# Altium schematic sheet dehumidifer_v2.SchDoc
size A4
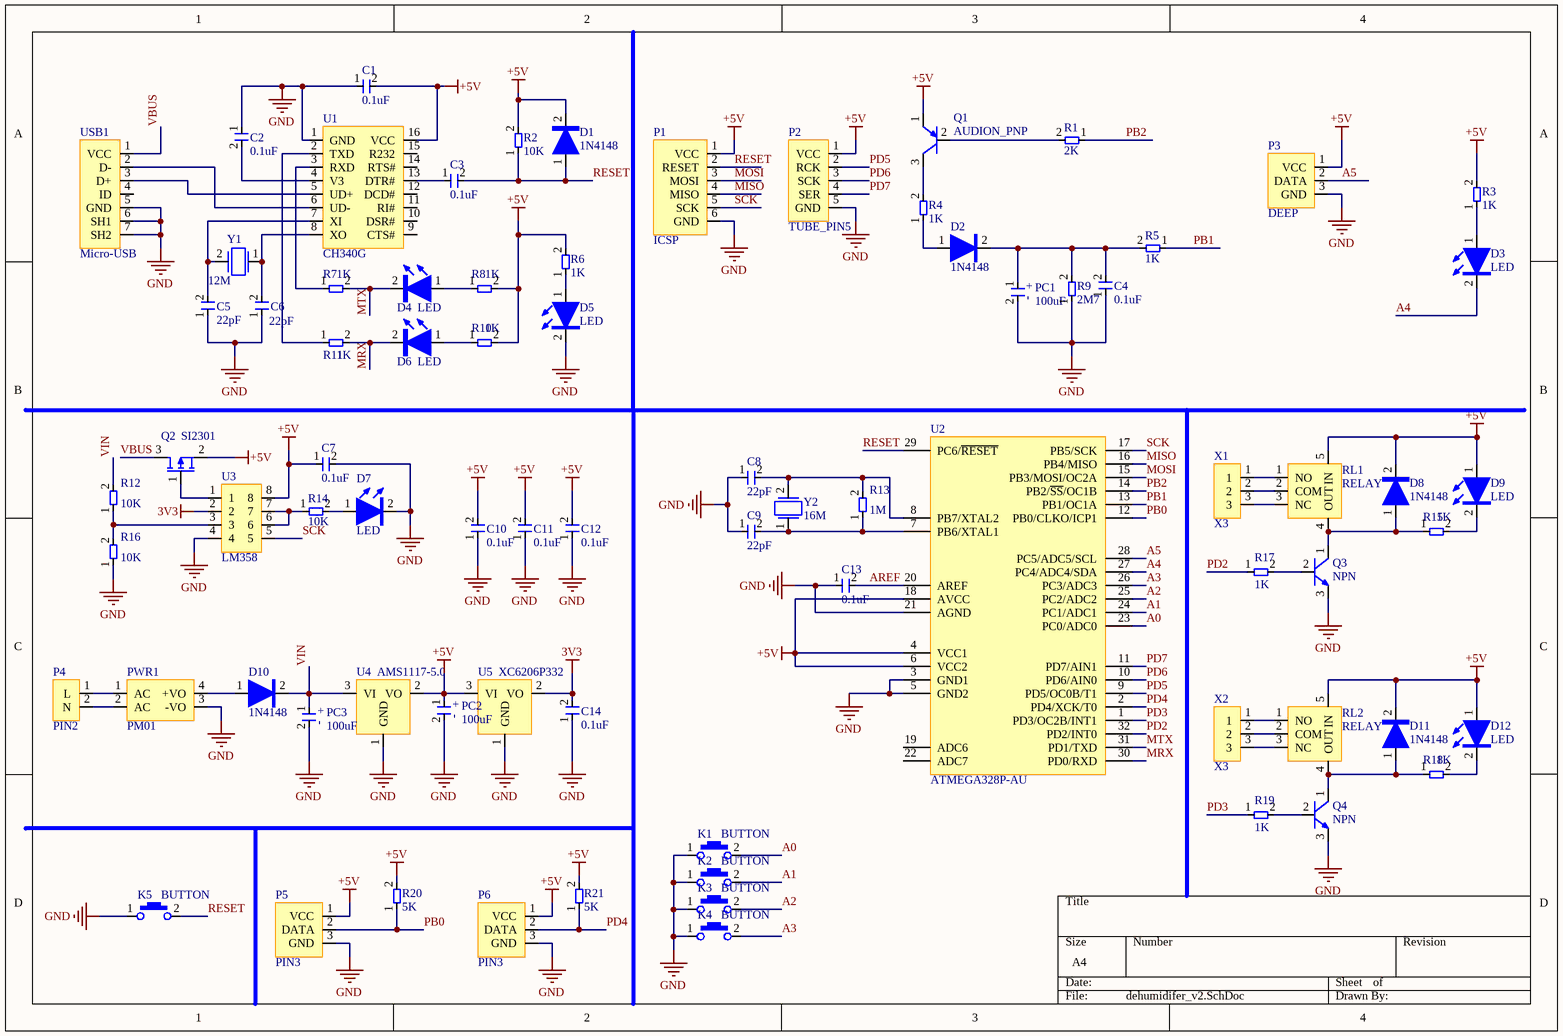
[diagram p0: dehumidifer_v2.SchDoc]

## Parts
C1  0.1uF  [CAP0805]
C2  0.1uF  [CAP0805]
C3  0.1uF  [CAP0805]
C4  0.1uF  [CAP0805]
C5  22pF  [CAP0805]
C6  22pF  [CAP0805]
C7  0.1uF  [CAP0805]
C8  22pF  [CAP0805]
C9  22pF  [CAP0805]
C10  0.1uF  [CAP0805]
C11  0.1uF  [CAP0805]
C12  0.1uF  [CAP0805]
C13  0.1uF  [CAP0805]
C14  0.1uF  [CAP0805]
D1  1N4148  [1N4148]
D2  1N4148  [1N4148]
D3  LED  [CON2]
D4  LED  [LED_CHIP0805]
D5  LED  [CON2]
D6  LED  [LED_CHIP0805]
D7  LED  [LED_CHIP0805]
D8  1N4148  [1N4148]
D9  LED  [CON2]
D10  1N4148  [1N4148]
D11  1N4148  [1N4148]
D12  LED  [CON2]
K1  BUTTON  [CON2]
K2  BUTTON  [CON2]
K3  BUTTON  [CON2]
K4  BUTTON  [CON2]
K5  BUTTON  [CON2]
P1  ICSP  [PIN6]
P2  TUBE_PIN5  [PIN5]
P3  DEEP  [CON3]
P4  PIN2  [CON2]
P5  PIN3  [CON3]
P6  PIN3  [CON3]
PC1  100uF  [CAP_VT]
PC2  100uF  [CAP_VT]
PC3  100uF  [CAP_VT]
PWR1  PM01  [PM01]
Q1  AUDION_PNP  [PNPSOT-23]
Q2  SI2301  [MOSSOT23]
Q3  NPN  [NPNSOT-23]
Q4  NPN  [NPNSOT-23]
R1  2K  [RES0805]
R2  10K  [RES0805]
R3  1K  [RES0805]
R4  1K  [RES0805]
R5  1K  [RES0805]
R6  1K  [RES0805]
R7  1K  [RES0805]
R8  1K  [RES0805]
R9  2M7  [RES0805]
R10  1K  [RES0805]
R11  1K  [RES0805]
R12  10K  [RES0805]
R13  1M  [RES0805]
R14  10K  [RES0805]
R15  1K  [RES0805]
R16  10K  [RES0805]
R17  1K  [RES0805]
R18  1K  [RES0805]
R19  1K  [RES0805]
R20  5K  [RES0805]
R21  5K  [RES0805]
RL1  RELAY  [RELAY]
RL2  RELAY  [RELAY]
U1  CH340G  [CH340G]
U2  ATMEGA328P-AU  [ATMEGA328P_AU]
U3  LM358  [LM358]
U4  AMS1117-5.0  [AMS1117]
U5  XC6206P332  [XC6206]
USB1  Micro-USB  [M_USB]
X1  X3  [CON3]
X2  X3  [CON3]
Y1  12M  [CRYSTAL]
Y2  16M  [CRYSTAL]

## Nets
3V3: C14.2 U3.2 U5.2(VO)
+5V: C1.2 C7.1 C10.2 C11.2 C12.2 D1.2 D8.2 D9.1 D11.2 D12.1 P1.1(VCC) P2.1(VCC) P3.1(VCC) P5.1(VCC) P6.1(VCC) PC2.1 Q1.1(e) Q2.2(S) R2.2 R3.2 R6.2 R8.2 R10.2 R20.2 R21.2 RL1.5(IN) RL2.5(IN) U1.16(VCC) U2.4(VCC1) U2.6(VCC2) U2.18(AVCC) U3.8 U4.2(VO) U5.3(VI)
GND: C1.1 C2.1 C4.1 C5.1 C6.1 C7.2 C8.1 C9.1 C10.1 C11.1 C12.1 C13.1 C14.1 D5.2 D7.2 K1.1 K2.1 K3.1 K4.1 K5.1 P1.6(GND) P2.5(GND) P3.3(GND) P5.3(GND) P6.3(GND) PC1.2 PC2.2 PC3.2 PWR1.3(-VO) Q3.3(c) Q4.3(c) R9.1 R16.1 U1.1(GND) U2.3(GND1) U2.5(GND2) U2.21(AGND) U3.4 U4.1(GND) U5.1(GND) USB1.5(GND) USB1.6(SH1) USB1.7(SH2)
A0: K1.2 U2.23(PC0/ADC0)
A1: K2.2 U2.24(PC1/ADC1)
A2: K3.2 U2.25(PC2/ADC2)
A3: K4.2 U2.26(PC3/ADC3)
A4: D3.2 U2.27(PC4/ADC4/SDA)
A5: P3.2(DATA) U2.28(PC5/ADC5/SCL)
AREF: C13.2 U2.20(AREF)
MISO: P1.4(MISO) U2.16(PB4/MISO)
MOSI: P1.3(MOSI) U2.15(PB3/MOSI/OC2A)
MRX: D6.2 R11.2 U2.30(PD0/RXD)
MTX: D4.2 R7.2 U2.31(PD1/TXD)
PB0: P5.2(DATA) R20.1 U2.12(PB0/CLKO/ICP1)
PB1: R5.1 U2.13(PB1/OC1A)
PB2: R1.1 U2.14(PB2/~{SS}/OC1B)
PD2: R17.1 U2.32(PD2/INT0)
PD3: R19.1 U2.1(PD3/OC2B/INT1)
PD4: P6.2(DATA) R21.1 U2.2(PD4/XCK/T0)
PD5: P2.2(RCK) U2.9(PD5/OC0B/T1)
PD6: P2.3(SCK) U2.10(PD6/AIN0)
PD7: P2.4(SER) U2.11(PD7/AIN1)
RESET: C3.2 D1.1 K5.2 P1.2(RESET) R2.1 U2.29(PC6/~{RESET})
SCK: P1.5(SCK) U2.17(PB5/SCK) U3.5
VBUS: Q2.3(D) USB1.1(VCC)
VIN: D10.2 PC3.1 R12.2 U4.3(VI)
NetC2_2: C2.2 U1.4(V3)
NetC3_1: C3.1 U1.13(DTR#)
NetC4_2: C4.2 D2.2 PC1.1 R5.2 R9.2
NetC5_2: C5.2 U1.7(XI) Y1.2
NetC6_2: C6.2 U1.8(XO) Y1.1
NetC8_2: C8.2 R13.2 U2.8(PB7/XTAL2) Y2.2
NetC9_2: C9.2 R13.1 U2.7(PB6/XTAL1) Y2.1
NetD2_1: D2.1 R4.1
NetD3_1: D3.1 R3.1
NetD4_1: D4.1 R8.1
NetD5_1: D5.1 R6.1
NetD6_1: D6.1 R10.1
NetD7_1: D7.1 R14.2
NetD8_1: D8.1 Q3.1(e) R15.1 RL1.4(OUT)
NetD9_2: D9.2 R15.2
NetD10_1: D10.1 PWR1.4(+VO)
NetD11_1: D11.1 Q4.1(e) R18.1 RL2.4(OUT)
NetD12_2: D12.2 R18.2
NetP4_1: P4.1(L) PWR1.1(AC)
NetP4_2: P4.2(N) PWR1.2(AC)
NetQ1_2: Q1.2(b) R1.2
NetQ1_3: Q1.3(c) R4.2
NetQ2_1: Q2.1(G) U3.1
NetQ3_2: Q3.2(b) R17.2
NetQ4_2: Q4.2(b) R19.2
NetR7_1: R7.1 U1.3(RXD)
NetR11_1: R11.1 U1.2(TXD)
NetR12_1: R12.1 R16.2 U3.3
NetR14_1: R14.1 U3.6 U3.7
NetRL1_1: RL1.1(NO) X1.1
NetRL1_2: RL1.2(COM) X1.2
NetRL1_3: RL1.3(NC) X1.3
NetRL2_1: RL2.1(NO) X2.1
NetRL2_2: RL2.2(COM) X2.2
NetRL2_3: RL2.3(NC) X2.3
NetU1_5: U1.5(UD+) USB1.3(D+)
NetU1_6: U1.6(UD-) USB1.2(D-)

Not connected (* = marked no-connect by the designer): U1 9(CTS#) 10(DSR#) 11(RI#) 12(DCD#) 14(RTS#) 15(R232); U2 19(ADC6) 22(ADC7); USB1 4(ID)

## Notes on the sheet
- (in symbol PAL CAP) +; -

## Library data of the parts
C1-C14 = CAP: 电容
D1 D2 D8 D10 D11 = 1N4148: 二极管
D3-D7 D9 D12 = LED: LED二极管
K1-K5 = BUTTON: 按钮
P3 = PIN3: 水位传感器
P4 = PIN2: 交流点插针
P5 P6 = PIN3: 温湿度传感器插针
PC1-PC3 = PAL CAP: 极性电容
PWR1 = PM01: 220V-5V降压模块
Q1 = AUDION_PNP: PNP三极管
Q2 = SI2301: MOS管
Q3 Q4 = NPN: NPN三极管
R1-R21 = RES: 电阻
X1 X2 = X3: 继电器接线柱
Y1 Y2 = CRYSTAL: 晶振